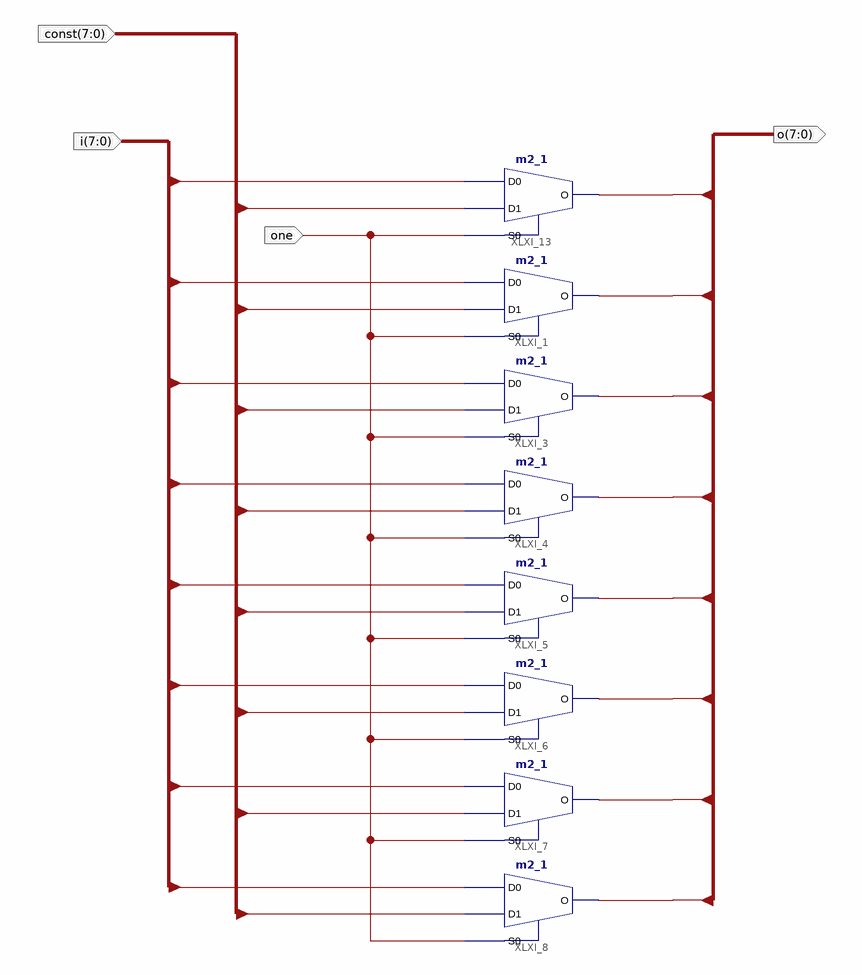
[diagram p0: schematic sheet 1]
// Xilinx ISE schematic pass_through_or_one.sch (aspartan6) as structural Verilog: 8 symbols, 4 ports
module pass_through_or_one (
  input  one,
  input  [7:0] i,
  input  [7:0] \const ,
  output [7:0] o
);

  m2_1 XLXI_1 (.D0(i[1]), .D1(\const [1]), .S0(one), .O(o[1]));
  m2_1 XLXI_3 (.D0(i[2]), .D1(\const [2]), .S0(one), .O(o[2]));
  m2_1 XLXI_4 (.D0(i[3]), .D1(\const [3]), .S0(one), .O(o[3]));
  m2_1 XLXI_5 (.D0(i[4]), .D1(\const [4]), .S0(one), .O(o[4]));
  m2_1 XLXI_6 (.D0(i[5]), .D1(\const [5]), .S0(one), .O(o[5]));
  m2_1 XLXI_7 (.D0(i[6]), .D1(\const [6]), .S0(one), .O(o[6]));
  m2_1 XLXI_8 (.D0(i[7]), .D1(\const [7]), .S0(one), .O(o[7]));
  m2_1 XLXI_13 (.D0(i[0]), .D1(\const [0]), .S0(one), .O(o[0]));
endmodule
